# Altium schematic sheet Top.SchDoc
size A4
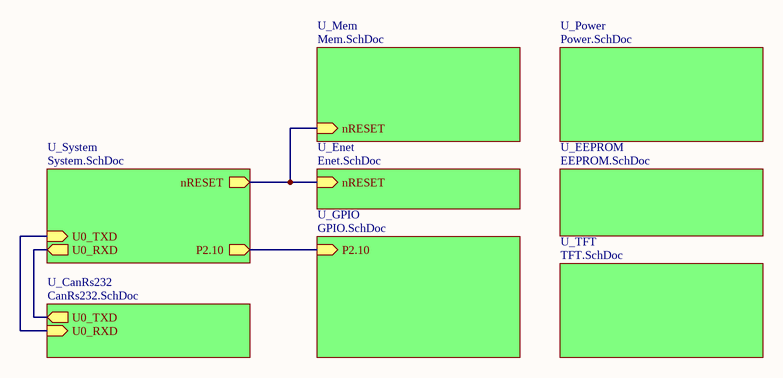
[diagram p0: Top.SchDoc]

## Sub-sheets
U_CanRs232 = CanRs232.SchDoc: U0_TXD (out), U0_RXD (in)
U_EEPROM = EEPROM.SchDoc: no entries
U_Enet = Enet.SchDoc: nRESET (in)
U_GPIO = GPIO.SchDoc: P2.10 (in)
U_Mem = Mem.SchDoc: nRESET (in)
U_Power = Power.SchDoc: no entries
U_System = System.SchDoc: nRESET (out), P2.10 (out), U0_TXD (in), U0_RXD (out)
U_TFT = TFT.SchDoc: no entries

## Nets
(unnamed): sheet U_CanRs232/U0_TXD, sheet U_System/U0_RXD
(unnamed): sheet U_CanRs232/U0_RXD, sheet U_System/U0_TXD
(unnamed): sheet U_Enet/nRESET, sheet U_Mem/nRESET, sheet U_System/nRESET
(unnamed): sheet U_GPIO/P2.10, sheet U_System/P2.10